# Altium schematic sheet Power.SchDoc
size 393 x 281 mm; DocumentNumber: 5; SheetNumber: 5; SheetTotal: 7; Format: A3; Abteilung: Entwicklung
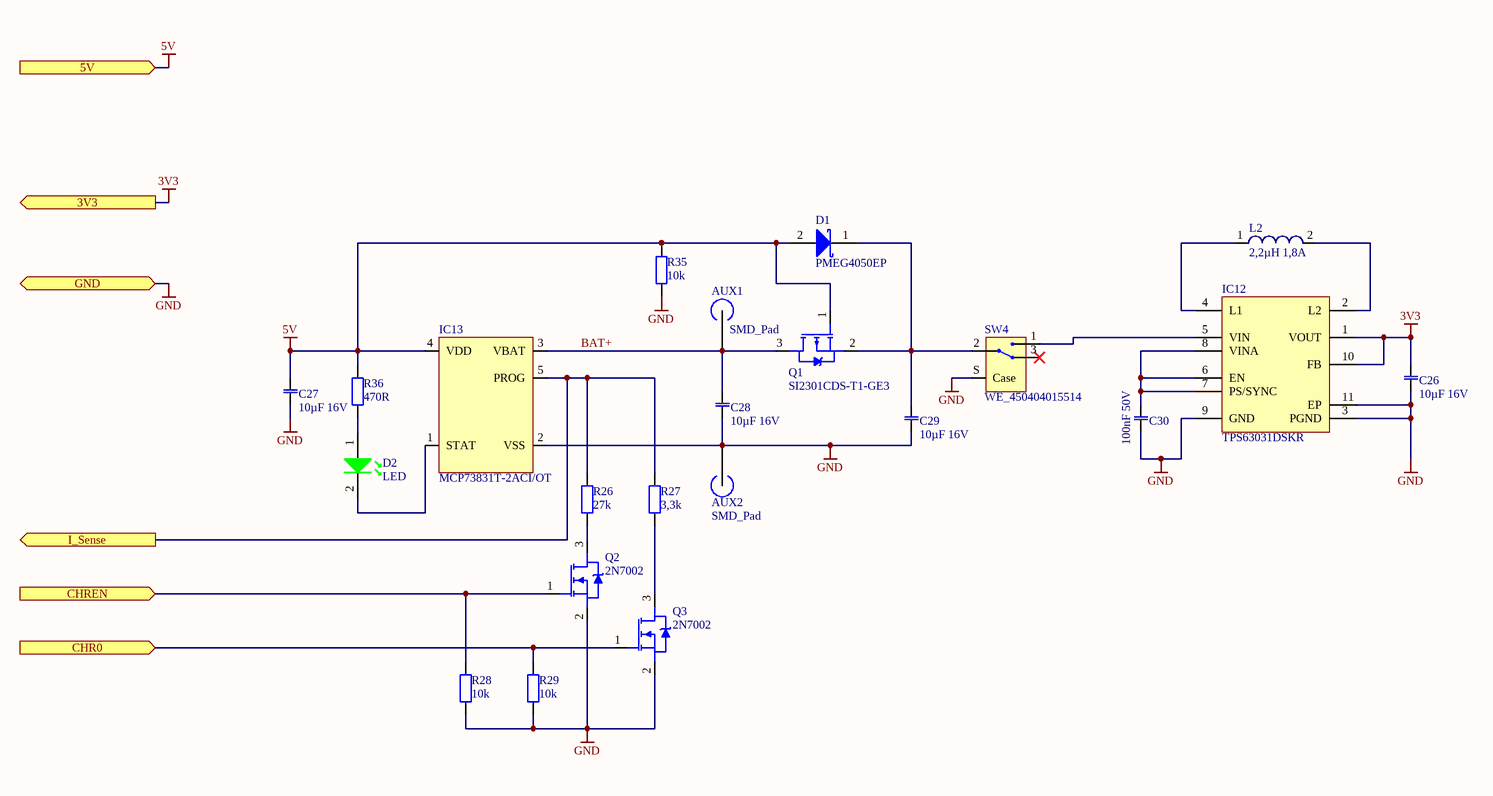
[diagram p0: Power.SchDoc]

## Parts
AUX1  SMD_Pad  [SMD_PAD]  (no BOM)
AUX2  SMD_Pad  [SMD_PAD]  (no BOM)
C26  10µF 16V  [CAPC1608L]
C27  10µF 16V  [CAPC1608L]
C28  10µF 16V  [CAPC1608L]
C29  10µF 16V  [CAPC1608L]
C30  100nF 50V  [CAPC1005N]
D1  PMEG4050EP  [SOD4725X110]
D2  LED  [LEDM1608X11_Green]
IC12  TPS63031DSKR  [SON50P250X80_HS-11N]
IC13  MCP73831T-2ACI/OT  [SOT95P275X110-5N]
L2  2,2µH 1,8A  [IND_WE_TPC_2828]
Q1  SI2301CDS-T1-GE3  [SOT95P237X112-3N]
Q2  2N7002  [SOT95P237X100-3N]
Q3  2N7002  [SOT95P237X100-3N]
R26  27k  [RESC1005L]
R27  3,3k  [RESC1005L]
R28  10k  [RESC1005L]
R29  10k  [RESC1005L]
R35  10k  [RESC1005L]
R36  470R  [RESC1005L]
SW4  WE_450404015514  [WE_450404015514]

## Ports
3V3 (out), 5V (in), CHR0 (in), CHREN (in), GND (bidir), I_Sense (out)

## Nets
3V3: C26.2 IC12.1(VOUT) IC12.10(FB) ; port 3V3
5V: C27.2 D1.2(A) IC13.4(VDD) Q1.1(G) R35.2 R36.2 ; port 5V
GND: AUX2.1 C26.1 C27.1 C28.1 C29.1 C30.1 IC12.3(PGND) IC12.9(GND) IC12.11(EP) IC13.2(VSS) Q2.2(S) Q3.2(S) R28.1 R29.1 R35.1 SW4.S(Case) ; port GND
BAT+: AUX1.1 C28.2 IC13.3(VBAT) Q1.3(D)
CHR0: Q3.1(G) R29.2 ; port CHR0
CHREN: Q2.1(G) R28.2 ; port CHREN
I_Sense: IC13.5(PROG) R26.1 R27.2 ; port I_Sense
NetC29_2: C29.2 D1.1(K) Q1.2(S) SW4.2
NetC30_2: C30.2 IC12.6(EN) IC12.7(PS/SYNC) IC12.8(VINA)
NetD2_1: D2.1 R36.1
NetD2_2: D2.2 IC13.1(STAT)
NetIC12_2: IC12.2(L2) L2.2
NetIC12_4: IC12.4(L1) L2.1
NetIC12_5: IC12.5(VIN) SW4.1
NetQ2_3: Q2.3(D) R26.2
NetQ3_3: Q3.3(D) R27.1

Not connected (* = marked no-connect by the designer): SW4 3*

## Notes on the sheet
- Date/Datum
- Name
- Identification No./Modell Nr.
- Classification/
- Checked
- Approved
- Issued
- Designation/Benennung
- Revision-Character/Versions-Buchstabe
- Verwendungsbereich
- Drawn/Hersteller
- Dept./Abt.
- iMAR Navigation GmbH
- Rev./Ver.
- Drawing No./Zeichnungsnummer
- Sheet/Blatt
- /
- Im Reihersbruch 3
- D-66386 St. Ingbert
- www.imar.de <http://www.imar.de>
- Filename/Dateiname
- Format
- A3

## Library data of the parts
AUX1 AUX2 = CMP-ROOT-0032-5: "Hilfs"-Pad auf PCB (um einer Kupferfläche ein definiertes Netz zuzuweisen); mit Lötstopmaske; ohne Pastenmaske
C26-C29 = CMP-002-0021-13: 10µF  16V  Ceramic  0603  10%  X5R; Manufacturer_PN: unspecified; Failure_in_Time_value: 0,000123; iMAR_PN: 00001-08334-0001; Temperature_min: -55°C; Temperature_max: 85°C; Failure_in_Time_notes: 55°C, 90% Upper Confidence Level, Daten von Wuerth verwendet; Case/Package: 0603; Kategorie: X5R; iComment: 10µF 16V; Tolerance: 10%; Mount: SMD; RoHS: Yes; Value: 10µF; Capacitor_Type: Ceramic; Manufacturer: unspecified; Voltage: 16V
C30 = CMP-002-0216-3: 100nF  50V  Ceramic  0402  10%  X7R; Manufacturer_PN: unspecified; Failure_in_Time_notes: 55°C, 90% Upper Confidence Level, Daten von Wuerth verwendet; Failure_in_Time_value: 0,000123; Temperature_min: -55°C; iMAR_PN: 00001-08791-0000; Temperature_max: 125°C; iComment: 100nF 50V; Capacitor_Type: Ceramic; Voltage: 50V; Mount: SMD; Case/Package: 0402; Manufacturer: unspecified; Kategorie: X7R; Tolerance: 10%; RoHS: Yes; Value: 100nF
D1 = CMP-016-0016-9: Schottky-Diode 5A low Vf; Manufacturer_PN: PMEG4050EP,115; Manufacturer: NEXPERIA; Temperature_max: 150°C; Failure_in_Time_notes: Ground Benign; MIL_HDBK_217F; Power Rectifier/ Schottky Pwr.; Ub: 40V; iMAR_PN: 00001-08163-0000; Uf: 430mV; Failure_in_Time_value: 0,0028; Temperature_min: -55°C; Power: 625mW; RoHS: Yes; Case/Package: SOD128; Mount: SMD; Pins: 2; Type: Schottky; If: 5A
D2 = CMP-008-0005-11: LED green 0603 2,2V 20mA; Manufacturer_PN: KP-1608SGC; Manufacturer: KINGBRIGHT; Temperature_max: 85°C; Uf_max: 2,5V; Ub: 5V; Temperature_min: -40°C; Uf: 2.2V; Failure_in_Time_notes: Ground Benign; MIL_HDBK_217F; Opto-Electronic/ Emitter; iMAR_PN: 00001-06615-0001; Power: 62.5mW; Failure_in_Time_value: 0,00047; Color: Green; Mount: SMD; Case/Package: 0603; Pins: 2; RoHS: Yes; If: 20mA; Type: LED
IC12 = CMP-ROOT-00527-1: High Efficient Single Inductor Buck-Boost Converter with 1-A Switches; Manufacturer: TEXAS INSTRUMENTS; Temperature_max: 125°C; Iout1: 1A; Temperature_min: -40°C; Vin_max: 5.5V; Vin_min: 1.8V; Power: 1W; Vout1: 3.3V; Mount: SMD; RoHS: Yes; Manufacturer_PN: TPS63031DSKR; Case/Package: WSON-10
IC13 = CMP-00018-3: Li-Polymer Charge Management Controller; Manufacturer: MICROCHIP TECHNOLOGY; Temperature_min: -40°C; Temperature_max: 125°C; iMAR_PN: 00001-08544-0000; Uin_max: 6V; Uin_min: 3.75V; RoHS: Yes; Pins: 5; Type: PMIC; Mount: SMD; Case/Package: SOT-23; Manufacturer_PN: MCP73831T-2ACI/OT
L2 = CMP-ROOT-00259-4: WE-TPC  2,2µH  1,8A  2,4A  0,057R; Manufacturer: WUERTH ELEKTRONIK; Manufacturer_PN: 744025002; Heigth: 2,8mm; Temperature_min: -40°C; Current_Saturation: 2.4A; Value: 2.2µH; iMAR_PN: 00001-06703-0002; Resistance: 57m; Temperature_max: 125°C; Current_Rated: 1.8A; Case/Package: TPC-2828; RoHS: Yes; Mount: SMD; Length: 2,8mm; Width: 2,8mm
Q1 = CMP-ROOT-0274-2: Leistungs-MOSFET, p-Kanal, 20 V, 3.1 A, 0.09 ohm, SOT-23, Oberflächenmontage; Manufacturer: VISHAY; Temperature_min: -55°C; Ids: 3.1A; Uds_max: -20V; Ciss: 405pF; Ugth: -1V; Ugs_max: 8V; Polarity: P; Mode: enhancement; iMAR_PN: 00001-09121-0000; Power: 1.6W; Temperature_max: 150°C; Type: MOSFET; RDSon: 90m; Case/Package: SOT23-3; RoHS: Yes; Manufacturer_PN: SI2301CDS-T1-GE3; Mount: SMD
Q2 Q3 = CMP-ROOT-0165-6: Leistungs-MOSFET, n-Kanal, 60 V, 115 mA, 1.2 ohm, SOT-23, Oberflächenmontage; Manufacturer: ON SEMICONDUCTOR; Ugth: 2.1V; Mode: enhancement; Temperature_min: -55°C; Ugs_max: 20V; Polarity: N; Failure_in_Time_value: 0,014; Temperature_max: 150°C; Ciss: 20pF; Ids: 115mA; iMAR_PN: 00001-07152-0001; Power: 200mW; RDSon: 1.2; Uds_max: 60V; Type: MOSFET; Failure_in_Time_notes: Ground Benign; MIL_HDBK_217F; Transistor/ Si. Field Effect (f <= 400MHz); Case/Package: SOT23; RoHS: Yes; Mount: SMD; Manufacturer_PN: 2N7002
R26 = CMP-001-0280-23: 27k  0402  62mW  1%  100ppm  50V; Manufacturer_PN: unspecified; TK: ±100; Failure_in_Time_value: 0,0001; iMAR_PN: 00001-09097-0000; Temperature_min: -40°C; Failure_in_Time_notes: 55°C, 60% Upper Confidence Level; Daten von Vishay verwendet; Temperature_max: 125°C; Mount: SMD; RoHS: Yes; Case/Package: 0402; iComment: 27k; Value: 27k; Power: 62mW; Voltage: 50V; Tolerance: 1%; Manufacturer: unspecified
R27 = CMP-001-0258-23: 3,3k  0402  62mW  1%  100ppm  50V; Manufacturer_PN: unspecified; Temperature_min: -40°C; Failure_in_Time_value: 0,0001; Value: 3.3k; Temperature_max: 125°C; iMAR_PN: 00001-07280-0000; TK: ±100; Failure_in_Time_notes: 55°C, 60% Upper Confidence Level; Daten von Vishay verwendet; Power: 62mW; RoHS: Yes; Manufacturer: unspecified; Tolerance: 1%; Mount: SMD; Case/Package: 0402; iComment: 3.3k; Voltage: 50V
R28 R29 R35 = CMP-001-0270-23: 10k  0402  62mW  1%  100ppm  50V; Manufacturer: unspecified; Failure_in_Time_notes: 55°C, 60% Upper Confidence Level; Daten von Vishay verwendet; Failure_in_Time_value: 0,0001; Temperature_min: -40°C; TK: ±100; iMAR_PN: 00001-06144-0004; Temperature_max: 125°C; RoHS: Yes; Value: 10k; Mount: SMD; iComment: 10k; Case/Package: 0402; Power: 62mW; Manufacturer_PN: unspecified; Tolerance: 1%; Voltage: 50V
R36 = CMP-001-0238-23: 470R  0402  62mW  1%  100ppm  50V; Manufacturer: unspecified; Failure_in_Time_value: 0,0001; TK: ±100; Value: 470; Failure_in_Time_notes: 55°C, 60% Upper Confidence Level; Daten von Vishay verwendet; Temperature_max: 125°C; Temperature_min: -40°C; iMAR_PN: 00001-07655-0000; Power: 62mW; Voltage: 50V; Manufacturer_PN: unspecified; RoHS: Yes; Tolerance: 1%; Case/Package: 0402; iComment: 470; Mount: SMD
SW4 = CMP-ROOT-00315-3: WS-SLSU Mini Slide Switch; Manufacturer: WUERTH ELEKTRONIK; iMAR_PN: 00001-00035-0000; IR: 300mA; Temperature_min: -40°C; Temperature_max: 85°C; Mount: SMD; Pins: 3; Manufacturer_PN: 450404015514; RoHS: Yes; Case/Package: 450404015514